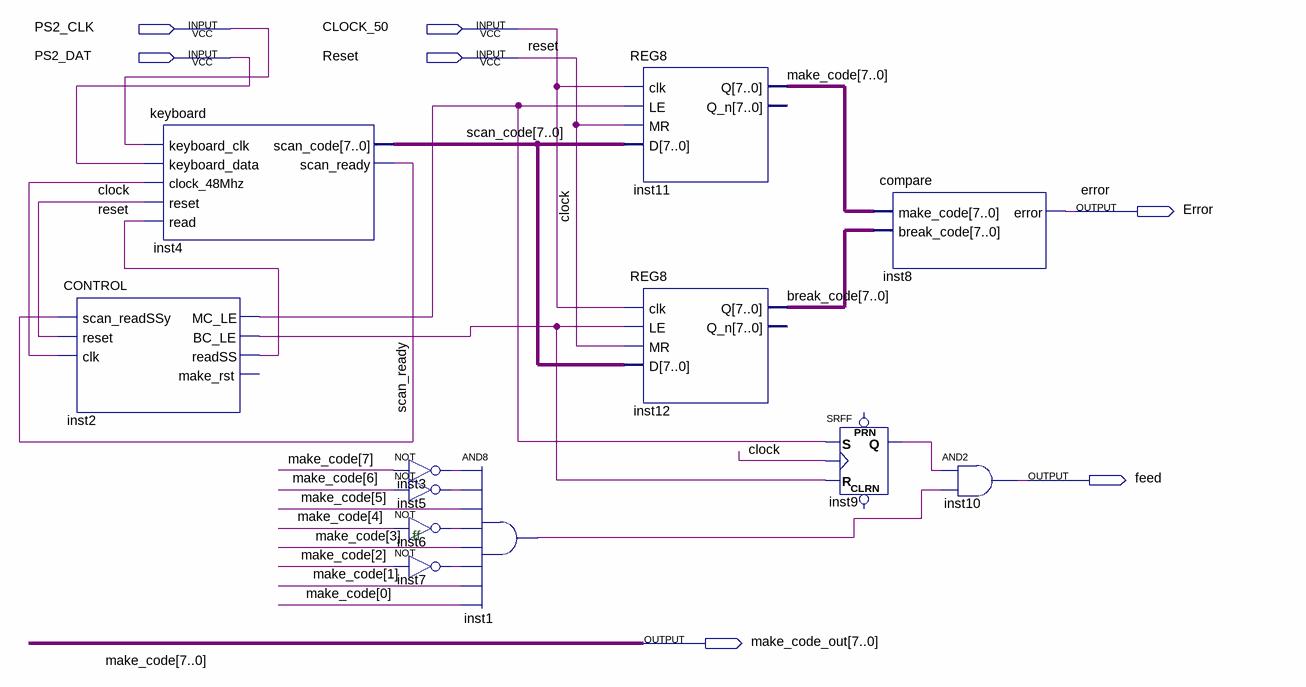
[diagram p0: schematic sheet]
// Quartus schematic keyboardTopLevel.bdf as structural Verilog: 12 symbols, 7 pins
module keyboardTopLevel (
  input  PS2_CLK,
  input  CLOCK_50,
  input  PS2_DAT,
  input  Reset,
  output Error,
  output feed,
  output [7:0] make_code_out
);

  wire inst1_out, inst2_bc_le, inst2_mc_le, inst2_readss, inst3_out, inst5_out, inst6_out, inst7_out,
       inst9_q, scan_ready;
  wire [7:0] break_code, scan_code;

  CONTROL inst2 (
    .scan_readSSy(scan_ready), .reset(Reset), .clk(CLOCK_50), .MC_LE(inst2_mc_le), .BC_LE(inst2_bc_le),
    .readSS(inst2_readss));  // open: make_rst
  keyboard inst4 (
    .keyboard_clk(PS2_CLK), .keyboard_data(PS2_DAT), .clock_48Mhz(CLOCK_50), .reset(Reset),
    .read(inst2_readss), .scan_code(scan_code), .scan_ready(scan_ready));
  and inst1 (inst1_out, inst3_out, inst5_out, make_code_out[5], inst6_out, make_code_out[3], inst7_out, make_code_out[1], make_code_out[0]);
  not inst3 (inst3_out, make_code_out[7]);
  not inst5 (inst5_out, make_code_out[6]);
  not inst6 (inst6_out, make_code_out[4]);
  not inst7 (inst7_out, make_code_out[2]);
  REG8 inst11 (.clk(CLOCK_50), .LE(inst2_mc_le), .MR(Reset), .D(scan_code), .Q(make_code_out));  // open: Q_n
  REG8 inst12 (.clk(CLOCK_50), .LE(inst2_bc_le), .MR(Reset), .D(scan_code), .Q(break_code));  // open: Q_n
  SRFF inst9 (.S(inst2_mc_le), .R(inst2_bc_le), .CLK(CLOCK_50), .Q(inst9_q));  // open: PRN, CLRN
  compare inst8 (.make_code(make_code_out), .break_code(break_code), .error(Error));
  and inst10 (feed, inst9_q, inst1_out);

  // Other names for the same wires on the sheet: clock = CLOCK_50; make_code[7:0] = make_code_out

  // Notes on the sheet:
  //   ff
endmodule
